# EAGLE design esc_shield (EAGLE 6.5.0)
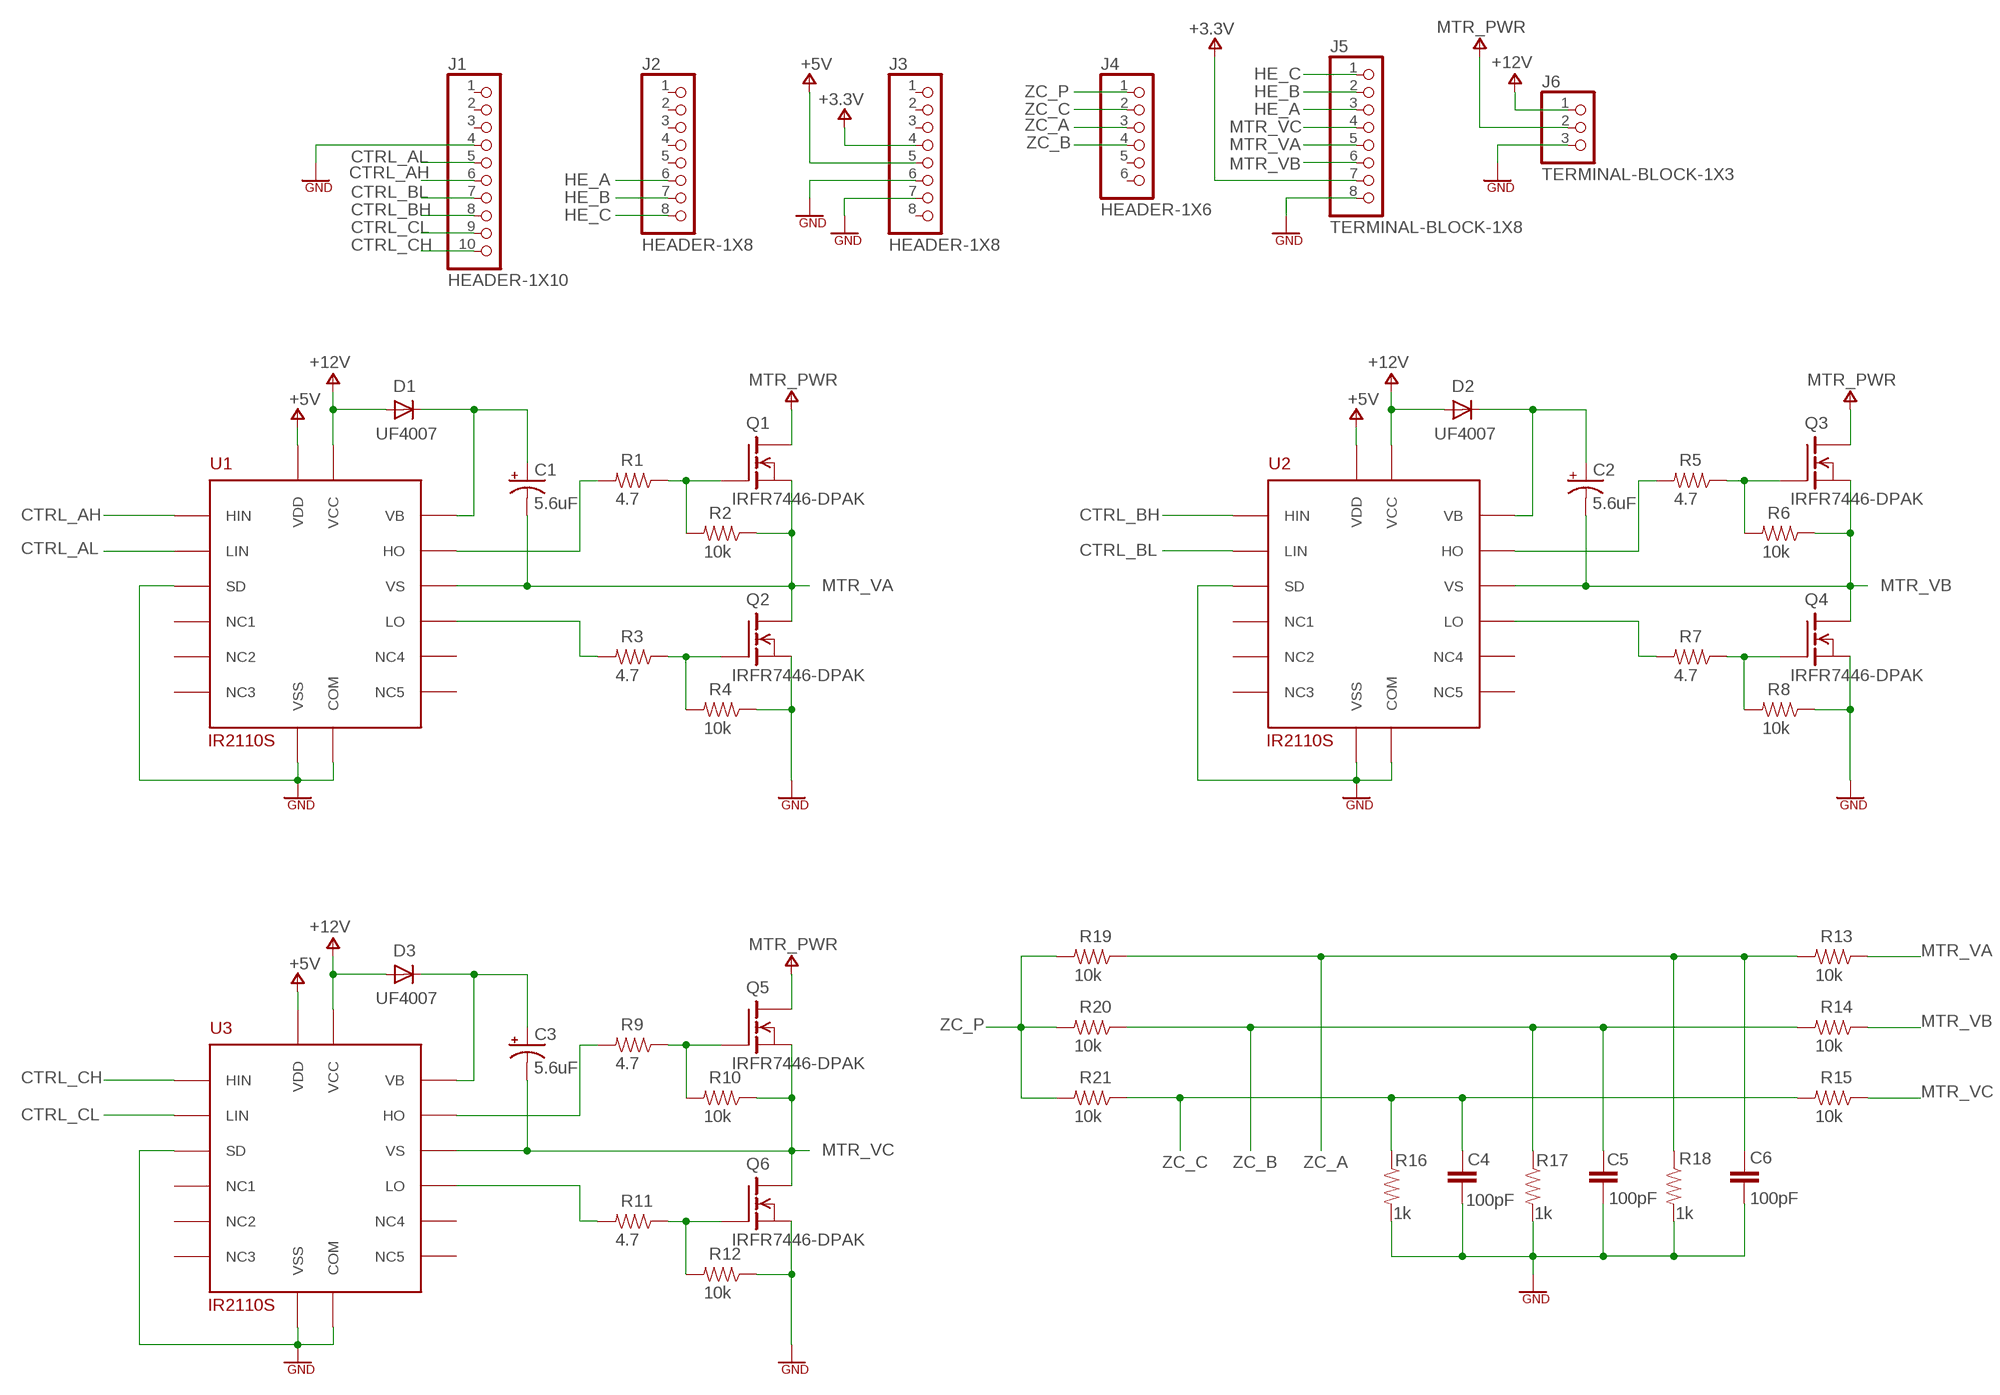
[diagram p0: schematic, sheet 1]

## Parts
C1  5.6uF  CAP_TANT  [EIA7343-31]
C2  5.6uF  CAP_TANT  [EIA7343-31]
C3  5.6uF  CAP_TANT  [EIA7343-31]
C4  100pF  CAP_0603  [SMD0603]
C5  100pF  CAP_0603  [SMD0603]
C6  100pF  CAP_0603  [SMD0603]
D1  UF4007  [DO41-10]
D2  UF4007  [DO41-10]
D3  UF4007  [DO41-10]
J1  HEADER-1X10  [1X10]
J2  HEADER-1X8  [1X08]
J3  HEADER-1X8  [1X08]
J4  HEADER-1X6  [1X06]
J5  TERMINAL-BLOCK-1X8  [1X08]
J6  TERMINAL-BLOCK-1X3  [1X03]
Q1  IRFR7446-DPAK  [TO252AA]
Q2  IRFR7446-DPAK  [TO252AA]
Q3  IRFR7446-DPAK  [TO252AA]
Q4  IRFR7446-DPAK  [TO252AA]
Q5  IRFR7446-DPAK  [TO252AA]
Q6  IRFR7446-DPAK  [TO252AA]
R1  4.7  RES_0603  [SMD0603]
R2  10k  RES_0603  [SMD0603]
R3  4.7  RES_0603  [SMD0603]
R4  10k  RES_0603  [SMD0603]
R5  4.7  RES_0603  [SMD0603]
R6  10k  RES_0603  [SMD0603]
R7  4.7  RES_0603  [SMD0603]
R8  10k  RES_0603  [SMD0603]
R9  4.7  RES_0603  [SMD0603]
R10  10k  RES_0603  [SMD0603]
R11  4.7  RES_0603  [SMD0603]
R12  10k  RES_0603  [SMD0603]
R13  10k  RES_0603  [SMD0603]
R14  10k  RES_0603  [SMD0603]
R15  10k  RES_0603  [SMD0603]
R16  1k  RES_0603  [SMD0603]
R17  1k  RES_0603  [SMD0603]
R18  1k  RES_0603  [SMD0603]
R19  10k  RES_0603  [SMD0603]
R20  10k  RES_0603  [SMD0603]
R21  10k  RES_0603  [SMD0603]
U1  IR2110S  [SO16L]
U2  IR2110S  [SO16L]
U3  IR2110S  [SO16L]

## Nets
3.3V: J3.4 J5.7 ; supply symbol labelled 3V3SUP
5V: J3.5 U1.11(VDD) U2.11(VDD) U3.11(VDD) ; supply symbol labelled 5VSUP
12V [large_power]: D1.A D2.A D3.A J6.1 U1.3(VCC) U2.3(VCC) U3.3(VCC) ; supply symbol labelled 12VSUP
BETWEEN_CAP_AND_DIODE: C1.+ D1.C U1.7(VB)
BETWEEN_CAP_AND_DIODE_2: C2.+ D2.C U2.7(VB)
CTRL_AH: J1.6 U1.12(HIN)
CTRL_AL: J1.5 U1.14(LIN)
CTRL_BH: J1.8 U2.12(HIN)
CTRL_BL: J1.7 U2.14(LIN)
CTRL_CH: J1.10 U3.12(HIN)
CTRL_CL: J1.9 U3.14(LIN)
GND: C4.2 C5.2 C6.2 J1.4 J3.6 J3.7 J5.8 J6.3 Q2.3(S) Q4.3(S) Q6.3(S) R4.1 R8.1 R12.1 R16.2 R17.2 R18.2 U1.2(COM) U1.13(SD) U1.15(VSS) U2.2(COM) U2.13(SD) U2.15(VSS) U3.2(COM) U3.13(SD) U3.15(VSS)
HE_A: J2.6 J5.3
HE_B: J2.7 J5.2
HE_C: J2.8 J5.1
MTR_PWR [motor_power]: J6.2 Q1.4(D) Q3.4(D) Q5.4(D)
MTR_VA [motor_power]: C1.- J5.5 Q1.3(S) Q2.4(D) R2.1 R13.1 U1.6(VS)
MTR_VB [motor_power]: C2.- J5.6 Q3.3(S) Q4.4(D) R6.1 R14.1 U2.6(VS)
MTR_VC [motor_power]: C3.- J5.4 Q5.3(S) Q6.4(D) R10.1 R15.1 U3.6(VS)
N$1: Q6.1(G) R11.1 R12.2
N$2: Q1.1(G) R1.1 R2.2
N$3: Q4.1(G) R7.1 R8.2
N$8: Q3.1(G) R5.1 R6.2
N$9: R11.2 U3.1(LO)
N$10: Q2.1(G) R3.1 R4.2
N$12: C3.+ D3.C U3.7(VB)
N$14: R9.2 U3.8(HO)
N$15: Q5.1(G) R9.1 R10.2
TO_Q1_GATE: R1.2 U1.8(HO)
TO_Q2_GATE: R3.2 U1.1(LO)
TO_Q3_GATE: R5.2 U2.8(HO)
TO_Q4_GATE: R7.2 U2.1(LO)
ZC_A: C6.1 J4.3 R13.2 R18.1 R19.1
ZC_B: C5.1 J4.4 R14.2 R17.1 R20.1
ZC_C: C4.1 J4.2 R15.2 R16.1 R21.1
ZC_P: J4.1 R19.2 R20.2 R21.2
Unconnected: J1.1 J1.2 J1.3 J2.1 J2.2 J2.3 J2.4 J2.5 J3.1 J3.2 J3.3 J3.8 J4.5 J4.6 U1.4(NC1) U1.5(NC2) U1.9(NC3) U1.10(NC4) U1.16(NC5) U2.4(NC1) U2.5(NC2) U2.9(NC3) U2.10(NC4) U2.16(NC5) U3.4(NC1) U3.5(NC2) U3.9(NC3) U3.10(NC4) U3.16(NC5)

## Library data of the parts
C1-C3 = esc_shield:CAP_TANT: Polarized capacitor (Tantalum)
C4-C6 = esc_shield:CAP: Non-polarized capacitor
D1-D3 = esc_shield:UF4007: Diode - Ultrafast recovery from Fairchild Semi
J1 = esc_shield:HEADER-1X10: Pin Header - 0.1 in spacing
J2 J3 = esc_shield:HEADER-1X8: Pin Header - 0.1 in spacing
J4 = esc_shield:HEADER-1X6: Pin Header - 0.1 in spacing
J5 = esc_shield:TERMINAL-BLOCK-1X8: 8-Pin Screw Terminal
J6 = esc_shield:TERMINAL-BLOCK-1X3: 3-Pin Screw Terminal
Q1-Q6 = esc_shield:IRFR7446-DPAK: N-Channel Enhancement Power MOSFET (HEXFET);
R1-R21 = esc_shield:RES: Resistor
U1-U3 = esc_shield:IR2110S: High-side/Low-side MOSFET Driver

## Net classes
0 default: width 0.203 mm
1 small_power: width 0.254 mm
2 large_power: width 0.305 mm
3 motor_power: width 0.406 mm, drill 0.61 mm

## Board
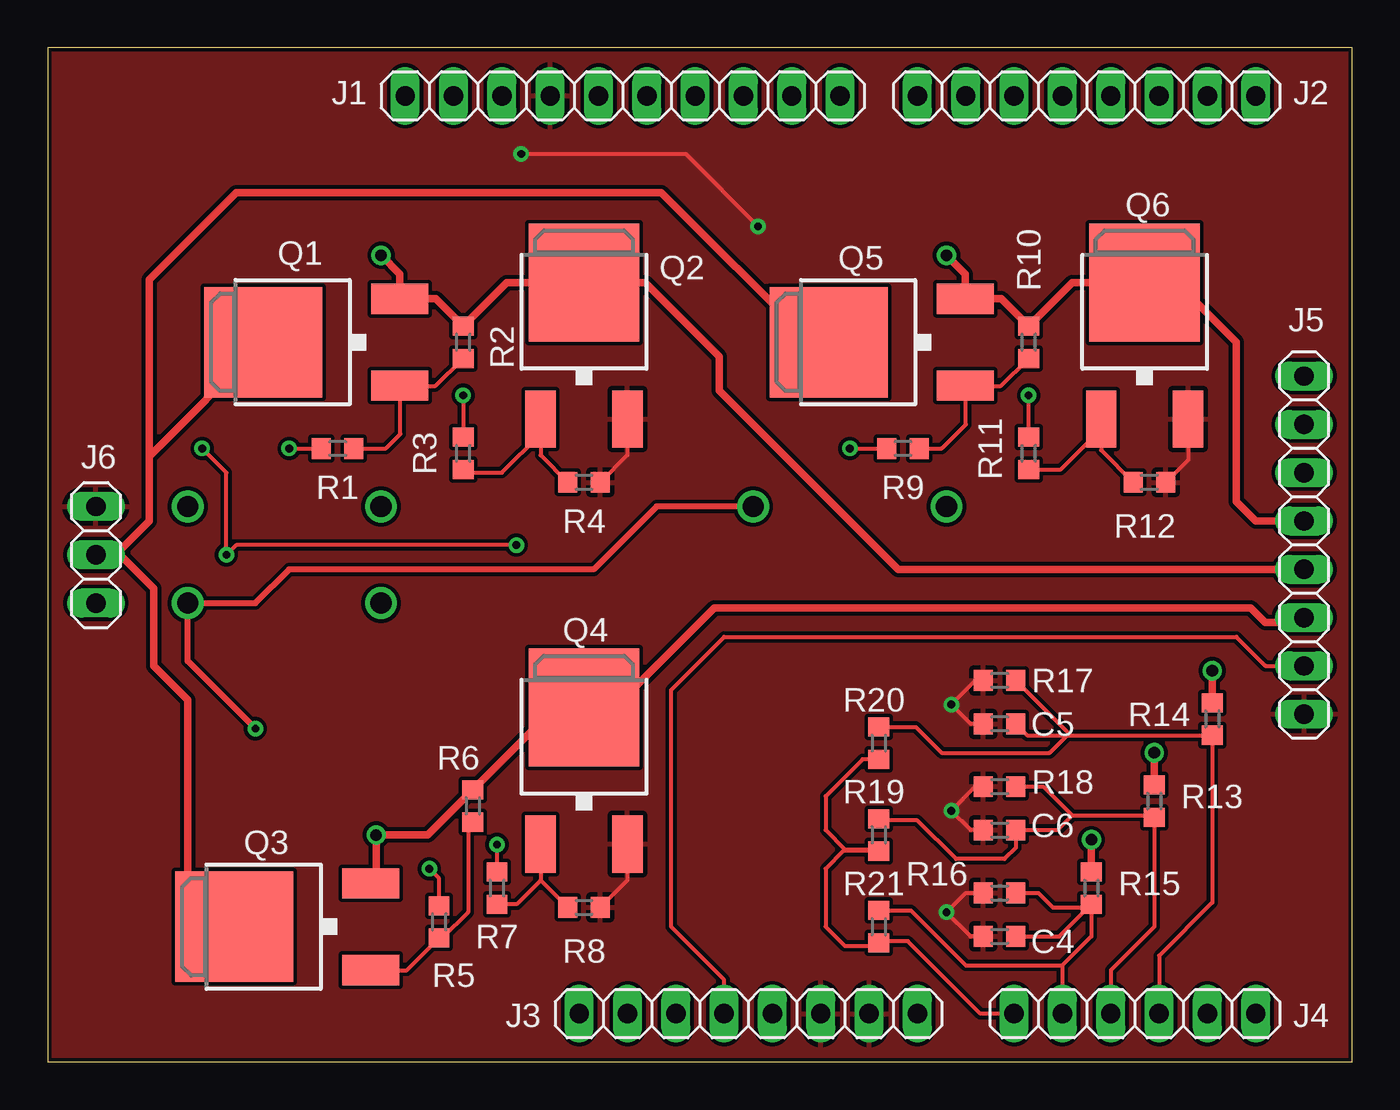
[diagram p1: board, top side]
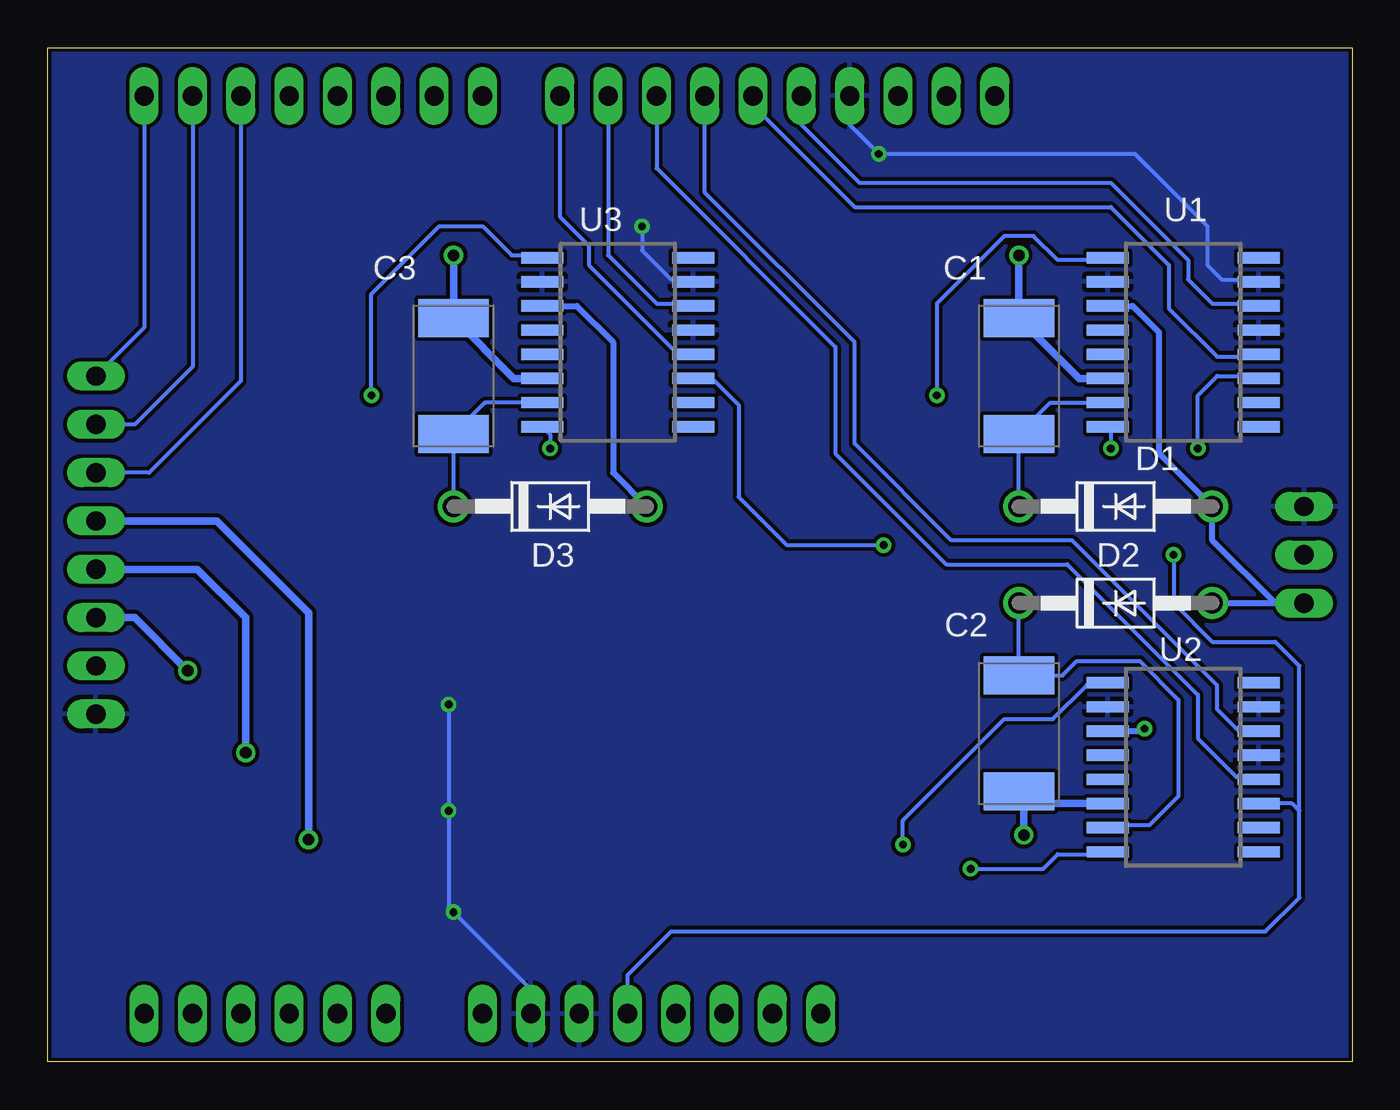
[diagram p2: board, bottom side, seen from below]

Size 68.58 x 53.34 mm. Coordinates in mm from the lower left corner, seen from the top.
Outline: 0,0 68.58,0 68.58,53.34 0,53.34 0,0
Copper layers (1*16): Top 0.035mm / dielectric 1.5mm / Bottom 0.035mm
Design rules "esc_shield": minimum track width 8mil, minimum drill 16mil, track to track 8mil, track to pad 8mil, pad to pad 8mil, via to via 8mil, smd to smd 8mil, copper to edge 8mil, drill to drill 8mil, minimum pad ring 10mil, minimum via ring 8mil, stop-mask expansion 4mil, vias tented up to drill 0mil, thermal gap 10mil

### Footprints (pad centres in the part's own frame; a part is rotated, then mirrored left to right if it is on the bottom)
EIA7343-31 = smd 2 x 3.7: + 3.048,0; - -3.048,0
SMD0603 = smd 1 x 1.1: 1 -0.85,0; 2 0.85,0
DO41-10 = drill 1.118: A 5.08,0; C -5.08,0
1X10 = drill 1.016 long: 1 -11.43,0; 2 -8.89,0; 3 -6.35,0; 4 -3.81,0; 5 -1.27,0; 6 1.27,0; 7 3.81,0; 8 6.35,0; 9 8.89,0; 10 11.43,0
1X08 = drill 1.016 long: 1 -8.89,0; 2 -6.35,0; 3 -3.81,0; 4 -1.27,0; 5 1.27,0; 6 3.81,0; 7 6.35,0; 8 8.89,0
1X06 = drill 1.016 long: 1 -6.35,0; 2 -3.81,0; 3 -1.27,0; 4 1.27,0; 5 3.81,0; 6 6.35,0
1X03 = drill 1.016 long: 1 -2.54,0; 2 0,0; 3 2.54,0
TO252AA = smd 1.6 x 3: 1 -2.28,-4.8; 3 2.28,-4.8 | smd 5.8 x 6.2: 4 0,2.38
SO16L = smd 2.2 x 0.6: 1 -3.965,4.445; 2 -3.965,3.175; 3 -3.965,1.905; 4 -3.965,0.635; 5 -3.965,-0.635; 6 -3.965,-1.905; 7 -3.965,-3.175; 8 -3.965,-4.445; 9 3.965,-4.445; 10 3.965,-3.175; 11 3.965,-1.905; 12 3.965,-0.635; 13 3.965,0.635; 14 3.965,1.905; 15 3.965,3.175; 16 3.965,4.445

### Placement (x,y rotation side)
C1  17.53,36.07 270 bottom
C2  17.53,17.27 90 bottom
C3  47.24,36.07 270 bottom
C4  50.04,6.6 180 top
C5  50.04,17.78 180 top
C6  50.04,12.19 180 top
D1  12.45,29.21 0 bottom
D2  12.45,24.13 0 bottom
D3  42.16,29.21 0 bottom
J1  30.23,50.8 0 top
J2  54.61,50.8 0 top
J3  36.83,2.54 0 top
J4  57.15,2.54 0 top
J5  66.04,27.18 270 top
J6  2.54,26.67 90 top
Q1  13.72,37.85 90 top
Q2  28.19,38.61 0 top
Q3  12.19,7.11 90 top
Q4  28.19,16.26 0 top
Q5  43.43,37.85 90 top
Q6  57.66,38.61 0 top
R1  15.24,32.26 180 top
R2  21.84,37.85 270 top
R3  21.84,32 90 top
R4  28.19,30.48 180 top
R5  20.57,7.37 90 top
R6  22.35,13.46 270 top
R7  23.62,9.14 90 top
R8  28.19,8.13 180 top
R9  44.96,32.26 180 top
R10  51.56,37.85 270 top
R11  51.56,32 90 top
R12  57.91,30.48 180 top
R13  58.17,13.72 270 top
R14  61.21,18.03 270 top
R15  54.86,9.14 270 top
R16  50.04,8.89 180 top
R17  50.04,20.07 180 top
R18  50.04,14.48 180 top
R19  43.69,11.94 270 top
R20  43.69,16.76 270 top
R21  43.69,7.11 270 top
U1  8.89,37.85 0 bottom
U2  8.89,15.49 0 bottom
U3  38.61,37.85 0 bottom

### Tracks (layer width: path | path; a pad name or v marks a point on that pad's centre or on a via)
3.3V
  Top 0.203: J3.4 35.56,4.32 32.77,7.11 32.77,19.56 35.56,22.35 62.48,22.35 64.01,20.83 J5.7
5V  (via drill 0.41)
  Top 0.203: v8.13,32.26 9.4,30.99 v9.4,26.67 9.91,27.18 v24.64,27.18
  Bottom 0.203: J3.5 38.1,4.57 35.81,6.86 4.57,6.86 2.79,8.64 2.79,13.21 | U2.11 3.17,13.59 2.79,13.21 | 2.79,13.21 2.79,20.83 4.06,22.1 7.37,22.1 9.4,24.13 v9.4,26.67 | v8.13,32.26 8.13,35.05 7.11,36.07 5.05,36.07 U1.11 | U3.11 33.66,35.94 32.26,34.54 32.26,29.72 29.72,27.18 v24.64,27.18
12V  (via drill 0.41)
  Top 0.305: v10.92,17.53 7.37,21.08 D2.A 10.92,24.13 12.7,25.91 28.7,25.91 32,29.21 D3.A
  Bottom 0.305: J6.1 4.06,24.13 | 4.06,24.13 7.37,27.43 D1.A 10.16,32 10.16,38.35 11.56,39.75 U1.3 | D2.A 4.06,24.13 | 12.73,17.27 U2.3 11.05,17.4 v10.92,17.53 | U3.3 40.77,39.75 38.86,37.85 38.86,30.99 D3.A
BETWEEN_CAP_AND_DIODE
  Bottom 0.203: D1.C C1.+ 15.88,34.67 U1.7
BETWEEN_CAP_AND_DIODE_2
  Bottom 0.203: D2.C C2.+ 15.24,20.32 14.48,21.08 11.18,21.08 9.14,19.05 9.14,13.97 10.67,12.45 12.73,12.45 U2.7
CTRL_AH
  Bottom 0.203: J1.6 31.5,50.29 26.16,44.96 12.7,44.96 9.65,41.91 9.65,39.62 7.11,37.08 5.05,37.08 U1.12
CTRL_AL
  Bottom 0.203: J1.5 28.96,49.28 25.91,46.23 12.7,46.23 8.64,42.16 8.64,41.15 7.37,39.88 5.05,39.88 U1.14
CTRL_BH
  Bottom 0.203: J1.8 36.58,46.99 27.18,37.59 27.18,32 21.34,26.16 14.99,26.16 8.13,19.3 8.13,17.02 6.1,14.99 5.05,14.99 U2.12
CTRL_BL
  Bottom 0.203: U2.14 5.97,17.4 7.11,18.54 7.11,19.81 14.73,27.43 21.08,27.43 26.16,32.51 26.16,37.85 34.04,45.72 J1.7
CTRL_CH
  Bottom 0.203: U3.12 34.77,37.34 35.56,37.34 40.13,41.91 40.13,42.93 41.66,44.45 J1.10
CTRL_CL
  Bottom 0.203: J1.9 39.12,42.42 36.58,39.88 35.56,39.88 34.77,39.88 U3.14
GND  (via drill 0.41)
  Top 0.203: Q2.3 30.47,31.91 R4.1 | Q4.3 30.47,9.56 R8.1 | Q6.3 59.94,31.66 R12.1 | v24.89,47.75 33.53,47.75 v37.34,43.94 | C4.2 48.51,6.6 v47.24,7.87 48.26,8.89 R16.2 | C6.2 48.51,12.19 v47.5,13.21 48.77,14.48 R18.2 | C5.2 48.51,17.78 v47.5,18.8 48.77,20.07 R17.2
  Bottom 0.203: J1.4 26.42,49.28 v24.89,47.75 11.43,47.75 7.62,43.94 7.62,41.91 6.86,41.15 5.05,41.15 U1.15 | v37.34,43.94 37.34,42.67 35.81,41.15 34.77,41.15 U3.15 | J3.7 43.18,3.81 v47.24,7.87 47.5,8.13 v47.5,13.21 v47.5,18.8
  pour Top: 0.25,53.09 0.25,0.25 68.33,0.25 68.33,53.09
  pour Bottom: 0.25,53.09 0.25,0.25 68.33,0.25 68.33,53.09
HE_A
  Bottom 0.203: J2.6 58.42,35.81 63.25,30.99 J5.3
HE_B
  Bottom 0.203: J2.7 60.96,36.58 64.01,33.53 J5.2
HE_C
  Bottom 0.203: J2.8 63.5,38.61 J5.1
MTR_PWR
  Top 0.406: J6.2 3.56,26.67 | 3.56,26.67 5.33,28.45 5.33,31.75 5.33,31.84 | 5.33,31.84 Q1.4 | Q3.4 7.37,9.56 7.37,19.05 5.59,20.83 5.59,24.89 3.81,26.67 3.56,26.67 | Q5.4 40.13,37.85 32.26,45.72 9.91,45.72 5.33,41.15 5.33,31.84
MTR_VA  (via drill 0.61)
  Top 0.406: v17.53,42.42 18.52,41.43 Q1.3 20.41,40.13 R2.1 24.14,40.99 Q2.4 31.4,40.99 35.31,37.08 35.31,35.31 44.7,25.91 J5.5 | R13.1 v58.17,16.26
  Bottom 0.406: v17.53,42.42 C1.- 14.35,35.94 U1.6 | v58.17,16.26 58.17,23.37 60.71,25.91 J5.5
MTR_VB  (via drill 0.61)
  Top 0.406: Q3.3 17.27,9.67 v17.27,11.94 19.98,11.94 R6.1 26.68,18.64 Q4.4 29.81,18.64 35.05,23.88 63.25,23.88 64.01,23.11 65.79,23.11 J5.6 | R14.1 v61.21,20.57
  Bottom 0.406: U2.6 16.89,13.59 | 16.89,13.59 C2.- | 16.89,13.59 17.27,13.59 v17.27,11.94 | v61.21,20.57 64.01,23.37 J5.6
MTR_VC  (via drill 0.61)
  Top 0.406: v47.24,42.42 48.23,41.43 Q5.3 50.13,40.13 R10.1 53.85,40.99 Q6.4 59.34,40.99 62.48,37.85 62.48,29.46 63.5,28.45 J5.4 | R15.1 v54.86,11.68
  Bottom 0.406: U3.6 44.07,35.94 C3.- v47.24,42.42 | J5.4 59.69,28.45 54.86,23.62 v54.86,11.68
N$1
  Top 0.203: Q6.1 55.38,33.27 | 55.38,33.27 55.38,32.16 R12.2 | R11.1 53.26,31.15 55.38,33.27
N$2
  Top 0.203: R1.1 17.78,32.26 18.54,33.02 18.54,35.54 | 18.54,35.54 Q1.1 | 18.54,35.54 20.39,35.54 R2.2
N$3
  Top 0.203: Q4.1 25.91,9.56 | 25.91,9.56 R8.2 | 25.91,9.56 24.65,8.29 R7.1
N$8
  Top 0.203: R6.2 22.1,12.36 22.1,7.87 20.74,6.52 R5.1 18.89,4.83 Q3.1
N$9  (via drill 0.41)
  Top 0.203: R11.2 v51.56,35.05
  Bottom 0.203: v51.56,35.05 51.56,40.39 48.01,43.94 45.72,43.94 44.2,42.42 42.7,42.42 U3.1
N$10
  Top 0.203: R3.1 22.01,30.99 23.88,30.99 25.91,33.03 | 25.91,33.03 Q2.1 | 25.91,33.03 25.91,31.91 R4.2
N$12
  Bottom 0.203: D3.C C3.+ 45.59,34.67 U3.7
N$14  (via drill 0.41)
  Top 0.203: v42.16,32.26 R9.2
  Bottom 0.203: U3.8 42.16,32.99 v42.16,32.26
N$15
  Top 0.203: R9.1 46.99,32.26 48.26,33.53 48.26,35.54 | 48.26,35.54 Q5.1 | 48.26,35.54 50.11,35.54 R10.2
TO_Q1_GATE  (via drill 0.41)
  Top 0.203: v12.7,32.26 R1.2
  Bottom 0.203: U1.8 12.7,33.4 v12.7,32.26
TO_Q2_GATE  (via drill 0.41)
  Top 0.203: v21.84,35.05 R3.2
  Bottom 0.203: U1.1 12.98,42.16 15.49,42.16 16.76,43.43 18.29,43.43 21.84,39.88 v21.84,35.05
TO_Q3_GATE  (via drill 0.41)
  Top 0.203: R5.2 20.57,9.65 v20.07,10.16
  Bottom 0.203: v20.07,10.16 16.26,10.16 15.49,10.92 12.98,10.92 U2.8
TO_Q4_GATE  (via drill 0.41)
  Top 0.203: R7.2 v23.62,11.43
  Bottom 0.203: v23.62,11.43 23.62,12.7 18.29,18.03 15.75,18.03 13.97,19.81 12.98,19.81 U2.1
ZC_A
  Top 0.203: J4.3 55.88,4.83 58.17,7.11 R13.2 58.08,12.95 53.85,12.95 | 53.85,12.95 53.09,12.19 C6.1 50.89,11.26 50.29,10.67 47.75,10.67 45.72,12.7 43.78,12.7 R19.1 | R18.1 52.32,14.48 53.85,12.95
ZC_B
  Top 0.203: J4.4 58.42,5.59 61.21,8.38 R14.2 53.77,17.18 | C5.1 51.48,17.18 53.59,17.18 | 53.59,17.18 53.77,17.18 | R17.1 53.77,17.18 | R20.1 45.63,17.61 46.99,16.26 52.67,16.26 53.59,17.18
ZC_C
  Top 0.203: R15.2 54.86,6.6 53.34,5.08 | 53.34,5.08 J4.2 | C4.1 53.17,6.6 R15.2 | R16.1 52.07,8.89 52.83,8.13 54.7,8.13 R15.2 | R21.1 45.38,7.96 48.26,5.08 53.34,5.08
ZC_P
  Top 0.203: R20.2 42.84,15.91 40.89,13.97 40.89,12.19 41.91,11.18 43.6,11.18 R19.2 41.82,11.09 40.89,10.16 40.89,7.11 41.91,6.1 43.52,6.1 R21.2 43.78,6.35 45.21,6.35 49.02,2.54 J4.1